# Altium schematic sheet SCH_BMS.SchDoc: Battery Management System
size A4; DrawnBy: Melvin Tong; Revision: v1.1; SheetNumber: 1; SheetTotal: 3
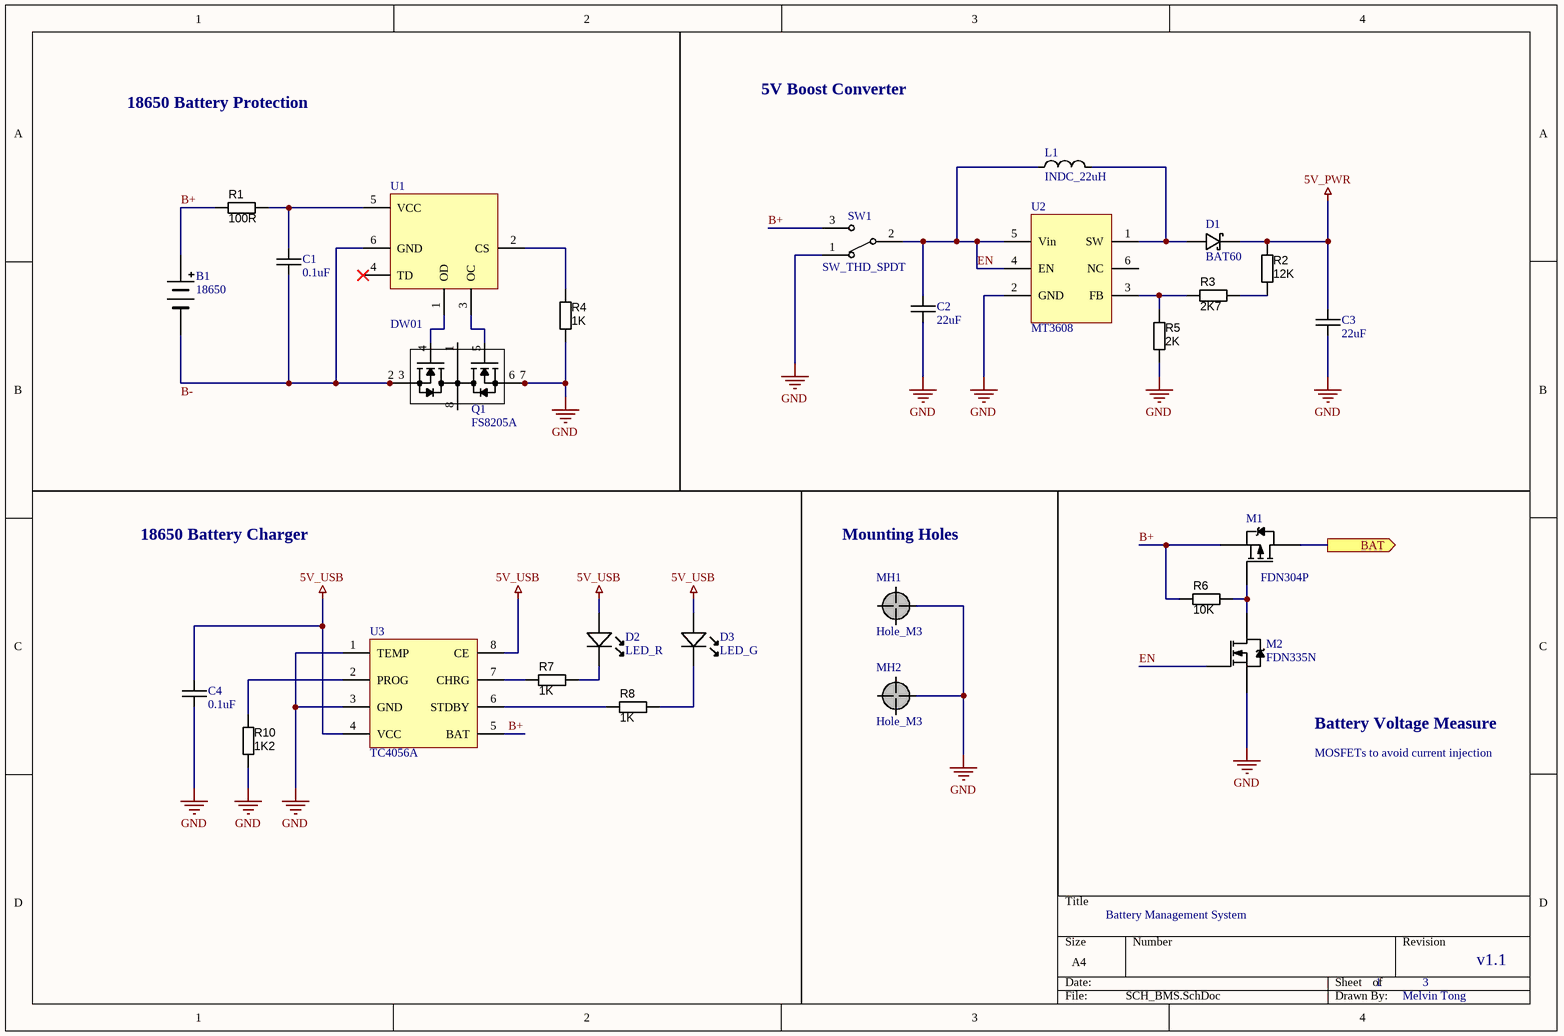
[diagram p0: SCH_BMS.SchDoc]

## Parts
B1  18650  [BAT_18650]
C1  0.1uF  [CAP_0805]
C2  22uF  [CAP_1206]
C3  22uF  [CAP_1206]
C4  0.1uF  [CAP_0805]
D1  BAT60  [SOD323]
D2  LED_R  [LED_0805]
D3  LED_G  [LED_0805]
L1  INDC_22uH  [IND_10x10]
M1  FDN304P  [SOT23_213]
M2  FDN335N  [SOT23_213]
MH1  Hole_M3  [Hole_M3]
MH2  Hole_M3  [Hole_M3]
Q1  FS8205A  [TSSOP65P640X120-8N]
R1  100R  [RESC3216X70N]
R2  12K  [RESC3216X70N]
R3  2K7  [RESC3216X70N]
R4  1K  [RESC3216X70N]
R5  2K  [RESC3216X70N]
R6  10K  [RESC3216X70N]
R7  1K  [RESC3216X70N]
R8  1K  [RESC3216X70N]
R10  1K2  [RESC3216X70N]
SW1  SW_THD_SPDT  [3P_header]
U1  DW01  [SOT23-6]
U2  MT3608  [SOT23-6]
U3  TC4056A  [SOIC127P600X175-8AN]

## Ports
BAT (out)

## Nets
5V_PWR: C3.1 D1.K R2.1
5V_USB: C4.1 D2.A D3.A U3.4(VCC) U3.8(CE)
GND: C2.2 C3.2 C4.2 M2.2(S) MH1.MH MH2.MH Q1.6(S1) Q1.7(S1) R4.2 R5.1 R10.2 SW1.1 U2.2(GND) U3.1(TEMP) U3.3(GND)
B+: B1.1(B+) M1.2(S) R1.1 R6.1 SW1.3 U3.5(BAT)
B-: B1.2(B+) C1.2 Q1.2(S1) Q1.3(S1) U1.6(GND)
BAT: M1.3(D) ; port BAT
EN: C2.1 L1.1 M2.1(G) SW1.2 U2.4(EN) U2.5(Vin)
NetC1_1: C1.1 R1.2 U1.5(VCC)
NetD1_A: D1.A L1.2 U2.1(SW)
NetD2_K: D2.K R7.2
NetD3_K: D3.K R8.2
NetM1_1: M1.1(G) M2.3(D) R6.2
NetQ1_4: Q1.4(G1) U1.1(OD)
NetQ1_5: Q1.5(G2) U1.3(OC)
NetR2_2: R2.2 R3.2
NetR3_1: R3.1 R5.2 U2.3(FB)
NetR4_1: R4.1 U1.2(CS)
NetR7_1: R7.1 U3.7(CHRG)
NetR8_1: R8.1 U3.6(STDBY)
NetR10_1: R10.1 U3.2(PROG)

Not connected (* = marked no-connect by the designer): Q1 1(D12) 8(D12); U1 4(TD)*; U2 6(NC)

## Notes on the sheet
- 18650 Battery Protection
- 5V Boost Converter
- 18650 Battery Charger
- Mounting Holes
- Battery Voltage Measure
- MOSFETs to avoid current injection

## Library data of the parts
B1 = Battery_18650
C1 C4 = CAP_0.1uF: SMD 0805
C2 C3 = CAP_22uF: SMD 1206
D1 = BAT60: Schottky Diode 3A, Vf~0.24V, Vr=10V
D2 = LED_R: SMD_0805 2V
D3 = LED_G: SMD_0805 3V
M1 = PMOS
M2 = NMOS
Q1 = FS8205A: NMOS, Drain-Connected, Imax 6A
R1 = RES_100R: Resistor SMD, 1206; Value: N/A
R2 = RES_12K: Resistor SMD, 1206; Value: N/A
R3 = RES_2K7: Resistor SMD, 1206; Value: N/A
R4 R7 R8 = RES_1K: Resistor SMD, 1206; Value: N/A
R5 = RES_2K: Resistor SMD, 1206; Value: N/A
R6 = RES_10K: Resistor SMD, 1206; Value: N/A
R10 = RES_1K2: Resistor SMD, 1206; Value: N/A
SW1 = SW_THD_SPDT: Switch 2 position
U2 = MT3608: Boost Converter